# Altium schematic sheet FPGA-3.SchDoc
size A3; Date: Date; CompanyName: HESSO; Engineer: Name; Address1: Route du Rawyl 47; Address2: 1950 Sion; Address3: Switzerland; ProjectName: Project Name
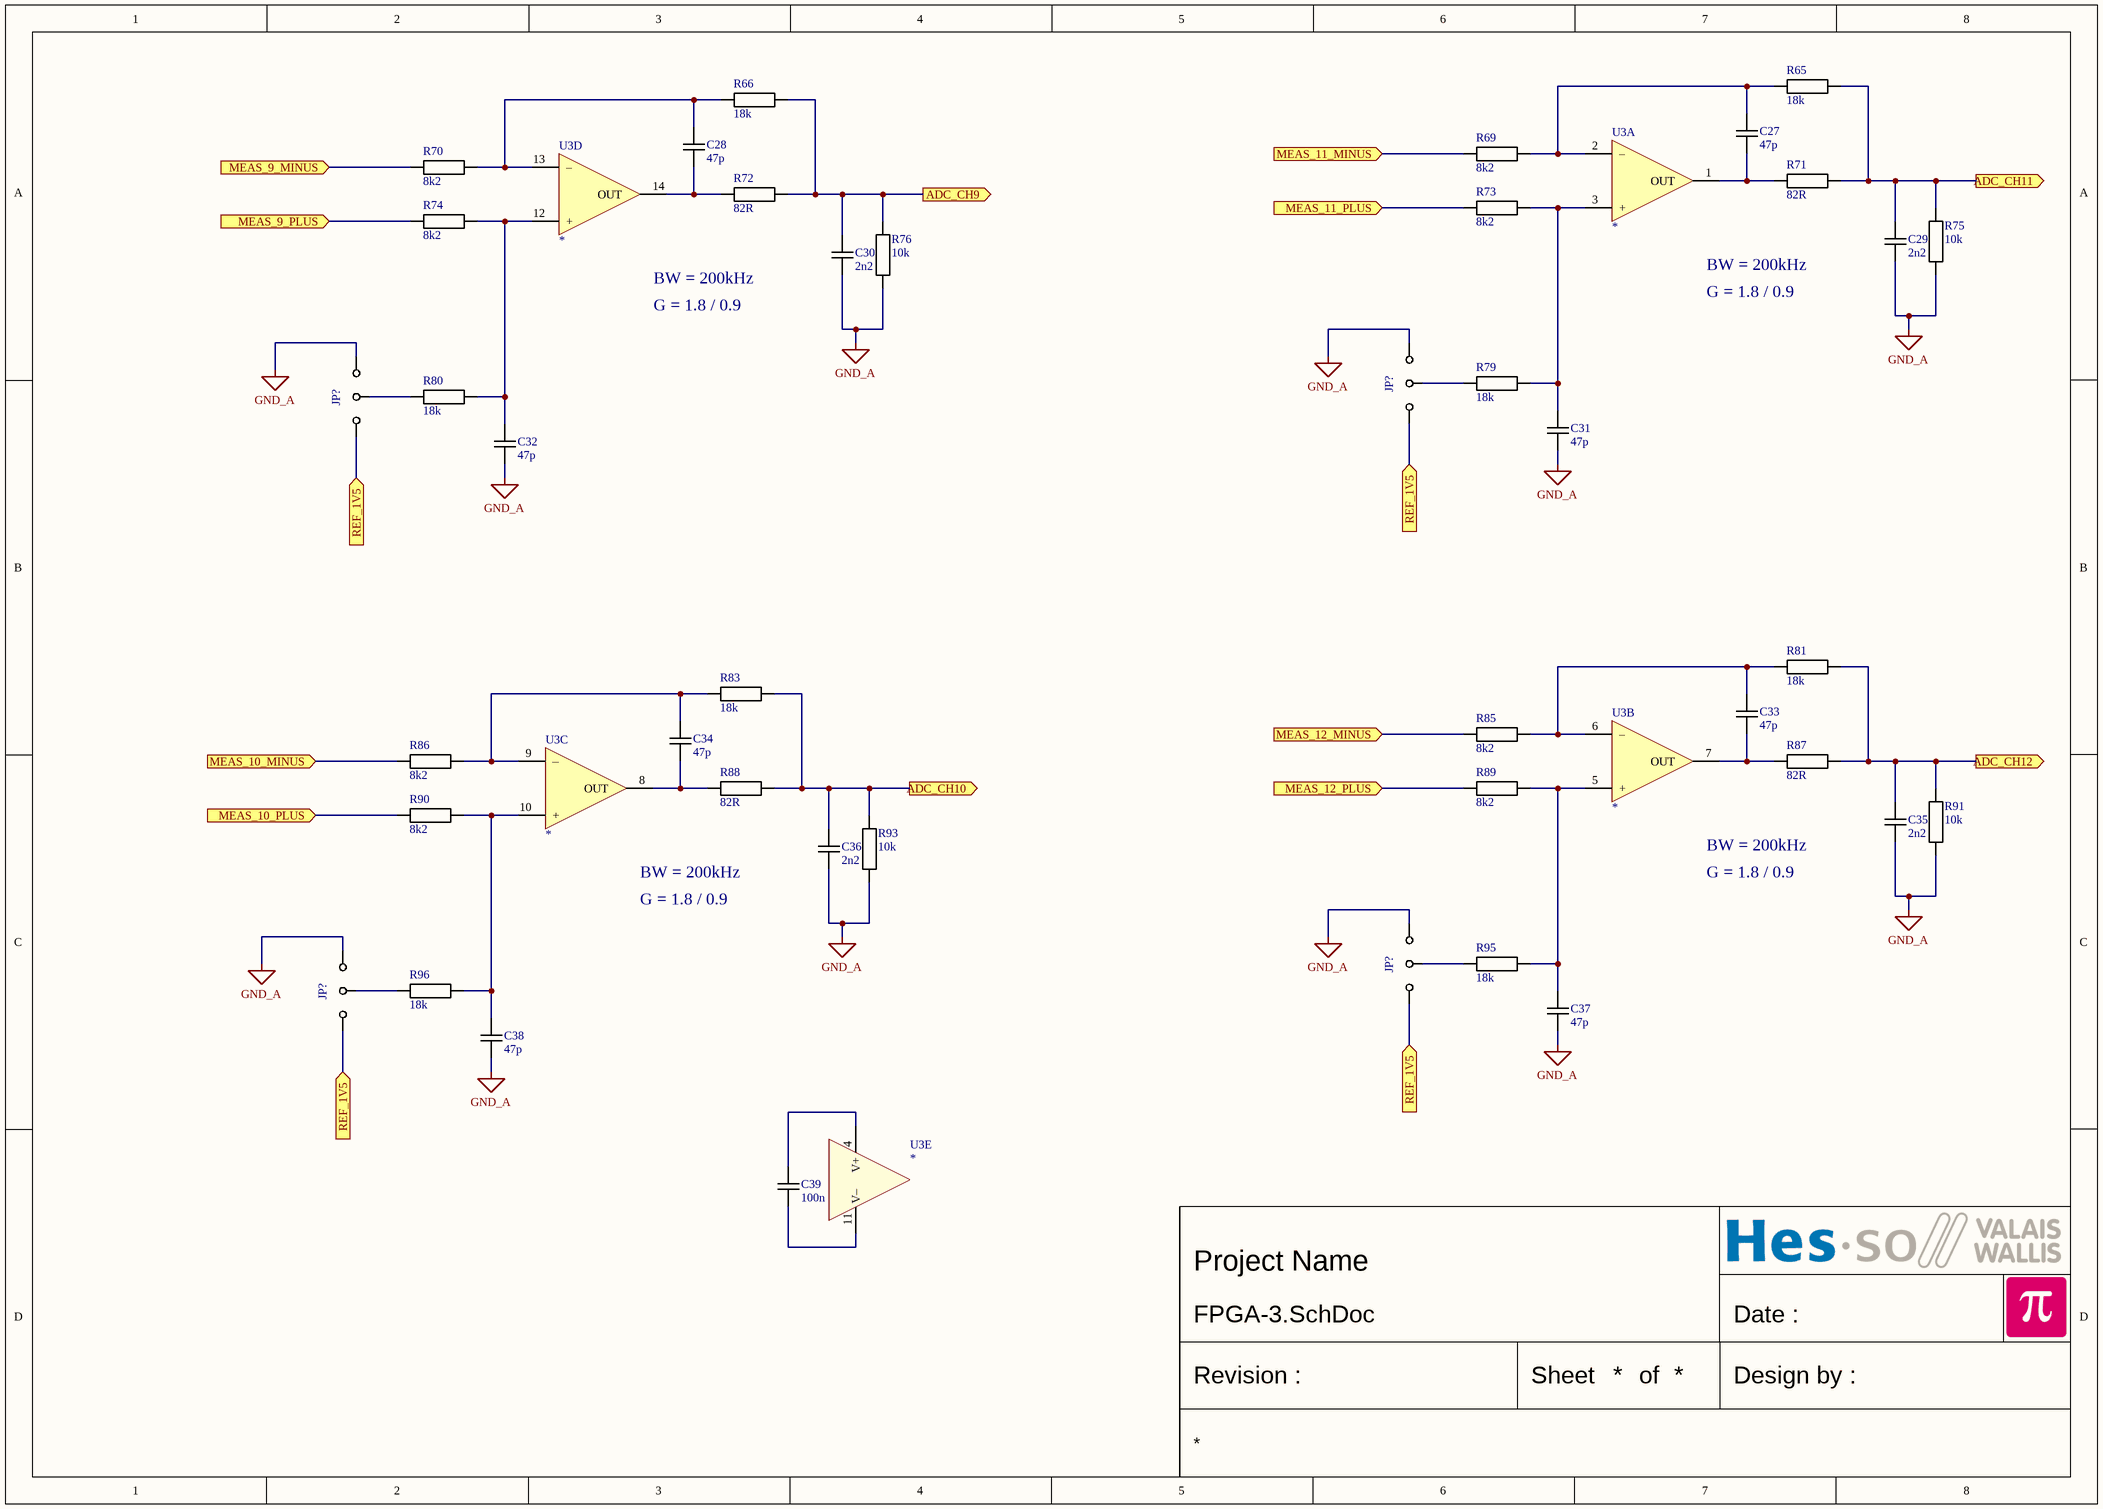
[diagram p0: FPGA-3.SchDoc]

## Parts
(Parts that share a designator on the sheet are numbered #1, #2 ... from top to bottom, then left to right.)
C27  47p  [CAPACITOR 1608 REFLOW]
C28  47p  [CAPACITOR 1608 REFLOW]
C29  2n2  [CAPACITOR 1608 REFLOW]
C30  2n2  [CAPACITOR 1608 REFLOW]
C31  47p  [CAPACITOR 1608 REFLOW]
C32  47p  [CAPACITOR 1608 REFLOW]
C33  47p  [CAPACITOR 1608 REFLOW]
C34  47p  [CAPACITOR 1608 REFLOW]
C35  2n2  [CAPACITOR 1608 REFLOW]
C36  2n2  [CAPACITOR 1608 REFLOW]
C37  47p  [CAPACITOR 1608 REFLOW]
C38  47p  [CAPACITOR 1608 REFLOW]
C39  100n  [CAPACITOR 1608 REFLOW]
JP?#1  {Value}  [JUMPER3 SMD 1608]  (value not drawn)
JP?#2  {Value}  [JUMPER3 SMD 1608]  (value not drawn)
JP?#3  {Value}  [JUMPER3 SMD 1608]  (value not drawn)
JP?#4  {Value}  [JUMPER3 SMD 1608]  (value not drawn)
R65  18k  [RESISTOR 1608 REFLOW]
R66  18k  [RESISTOR 1608 REFLOW]
R69  8k2  [RESISTOR 1608 REFLOW]
R70  8k2  [RESISTOR 1608 REFLOW]
R71  82R  [RESISTOR 1608 REFLOW]
R72  82R  [RESISTOR 1608 REFLOW]
R73  8k2  [RESISTOR 1608 REFLOW]
R74  8k2  [RESISTOR 1608 REFLOW]
R75  10k  [RESISTOR 1608 REFLOW]
R76  10k  [RESISTOR 1608 REFLOW]
R79  18k  [RESISTOR 1608 REFLOW]
R80  18k  [RESISTOR 1608 REFLOW]
R81  18k  [RESISTOR 1608 REFLOW]
R83  18k  [RESISTOR 1608 REFLOW]
R85  8k2  [RESISTOR 1608 REFLOW]
R86  8k2  [RESISTOR 1608 REFLOW]
R87  82R  [RESISTOR 1608 REFLOW]
R88  82R  [RESISTOR 1608 REFLOW]
R89  8k2  [RESISTOR 1608 REFLOW]
R90  8k2  [RESISTOR 1608 REFLOW]
R91  10k  [RESISTOR 1608 REFLOW]
R93  10k  [RESISTOR 1608 REFLOW]
R95  18k  [RESISTOR 1608 REFLOW]
R96  18k  [RESISTOR 1608 REFLOW]
U3  *  [SO14 P1.27 C4.0X8.8 H1.75]  (parts A,B,C,D,E of 5)

## Ports
ADC_CH9 (out), ADC_CH10 (out), ADC_CH11 (out), ADC_CH12 (out), MEAS_9_MINUS (in), MEAS_9_PLUS (in), MEAS_10_MINUS (in), MEAS_10_PLUS (in), MEAS_11_MINUS (in), MEAS_11_PLUS (in), MEAS_12_MINUS (in), MEAS_12_PLUS (in), REF_1V5 (in)

## Nets
GND_A: C29.1 C30.1 C31.1 C32.1 C35.1 C36.1 C37.1 C38.1 JP?#1.3 JP?#2.3 JP?#3.3 JP?#4.3 R75.2 R76.2 R91.2 R93.2
ADC_CH9: C30.2 R66.2 R72.2 R76.1 ; port ADC_CH9
ADC_CH10: C36.2 R83.2 R88.2 R93.1 ; port ADC_CH10
ADC_CH11: C29.2 R65.2 R71.2 R75.1 ; port ADC_CH11
ADC_CH12: C35.2 R81.2 R87.2 R91.1 ; port ADC_CH12
MEAS_9_MINUS: R70.1 ; port MEAS_9_MINUS
MEAS_9_PLUS: R74.1 ; port MEAS_9_PLUS
MEAS_10_MINUS: R86.1 ; port MEAS_10_MINUS
MEAS_10_PLUS: R90.1 ; port MEAS_10_PLUS
MEAS_11_MINUS: R69.1 ; port MEAS_11_MINUS
MEAS_11_PLUS: R73.1 ; port MEAS_11_PLUS
MEAS_12_MINUS: R85.1 ; port MEAS_12_MINUS
MEAS_12_PLUS: R89.1 ; port MEAS_12_PLUS
REF_1V5: JP?#1.1 JP?#2.1 JP?#3.1 JP?#4.1 ; port REF_1V5
NetC27_1: C27.1 R71.1 U3.1(OUT)
NetC27_2: C27.2 R65.1 R69.2 U3.2(–)
NetC28_1: C28.1 R72.1 U3.14(OUT)
NetC28_2: C28.2 R66.1 R70.2 U3.13(–)
NetC31_2: C31.2 R73.2 R79.1 U3.3(+)
NetC32_2: C32.2 R74.2 R80.1 U3.12(+)
NetC33_1: C33.1 R87.1 U3.7(OUT)
NetC33_2: C33.2 R81.1 R85.2 U3.6(–)
NetC34_1: C34.1 R88.1 U3.8(OUT)
NetC34_2: C34.2 R83.1 R86.2 U3.9(–)
NetC37_2: C37.2 R89.2 R95.1 U3.5(+)
NetC38_2: C38.2 R90.2 R96.1 U3.10(+)
NetC39_1: C39.1 U3.11(V–)
NetC39_2: C39.2 U3.4(V+)
NetJP?#1_2: JP?#1.2 R79.2
NetJP?#2_2: JP?#2.2 R80.2
NetJP?#3_2: JP?#3.2 R95.2
NetJP?#4_2: JP?#4.2 R96.2

## Notes on the sheet
- BW = 200kHz
- G = 1.8 / 0.9
- Date :
- Revision :
- Sheet
- of
- Design by :

## Library data of the parts
C27-C39 = Capacitor: Capacitor X7R 10% 50V 1608(0603)
  C27 C28 C31-C34 C37 C38: Value: 47p
  C29 C30 C35 C36: Value: 2n2
  C39: Value: 100n
JP?#1-JP?#4 = JUMPER 3 POS: Value: {Value}
R65 R66 R69-R76 R79-R81 R83 R85-R91 R93 R95 R96 = Resistor: Resistor 1% 50V 100mW 1608(0603)
  R65 R66 R79-R81 R83 R95 R96: Value: 18k
  R69 R70 R73 R74 R85 R86 R89 R90: Value: 8k2
  R71 R72 R87 R88: Value: 82R
  R75 R76 R91 R93: Value: 10k
U3 = OPA QUAD: Generic quad OPA 14 pins; Value: *